# Altium schematic sheet Buck_circuit.SchDoc
size A4; SheetNumber: 2; SheetTotal: 2
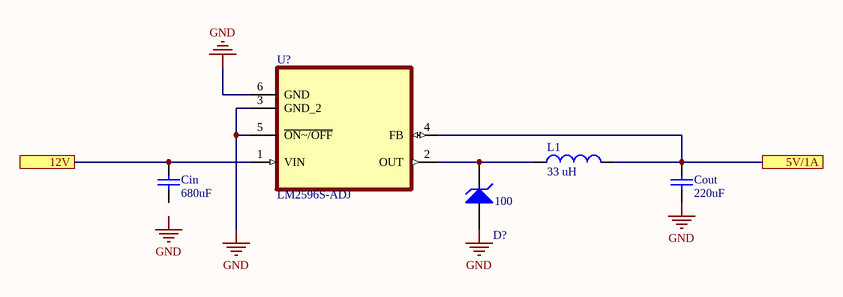
[diagram p0: Buck_circuit.SchDoc]

## Parts
Cin  value 680uF  (hidden comment: Capacitor)
Cout  value 220uF  (hidden comment: Capacitor)
D?  BV: 100  (hidden comment: Zener Diode)
L1  value 33 uH  (hidden comment: Inductor)
U?  LM2596S-ADJ  [TO170P1435X465-6N]

## Ports
5V/1A, 12V

## Nets
GND: Cout.1 D?.1(A) U?.3(GND_2) U?.5(~{ON~/OFF}) U?.6(GND)
5V/1A: Cout.2 L1.2 U?.4(FB) ; port 5V/1A
12V: Cin.2 U?.1(VIN) ; port 12V
NetD?_2: D?.2(K) L1.1 U?.2(OUT)

Not connected (* = marked no-connect by the designer): Cin 1

## Notes on the sheet
- Labels drawn without touching a wire or pin: GND

## Library data of the parts
Cin Cout = Capacitor: SimulationGenericComponent: True
D? = Zener Diode: AF: 1; BV_MAX: 1e99; CJO: 0; EG: 1.11; FC: 0.5; IBV: 0.001; IS: 1e-14; MJSW: 0.33; NTUN: 30; TNOM: 27; XTI: 3; SimulationGenericComponent: True; CJP: 0; CTA: 0; CTP: 0; FCS: 0.5; FV_MAX: 1e99; IKF: 0; IKR: 0; ISR: 1e-14; JSW: 0; JTUN: 0; JTUNSW: 0; KEG: 1; KF: 0; LEVEL: 1; N: 1; NBV: 1; NR: 1; NS: 1; PHP: 1; RS: 0; TCV: 0; TLEV: 0; TLEVC: 0; TM1: 0; TM2: 0; TPB: 0; TPHP: 0; TRS: 0; TRS2: 0; TT: 0; TTT1: 0; TTT2: 0; VJ: 1; XTITUN: 3
L1 = Inductor: SimulationGenericComponent: True
U? = LM2596S-ADJ: Buck Switching Regulator IC Positive Adjustable 1.2V 1 Output 3A TO-263-6, DÂ²Pak (5 Leads + Tab), TO-263BA; MF: UMW; SnapEDA_Link: https://www.snapeda.com/parts/LM2596S-ADJ/Umwelt+Sensor+Teknik/view-part/?ref=snap; Package: None; Value: *; MP: LM2596S-ADJ; Check_prices: https://www.snapeda.com/parts/LM2596S-ADJ/Umwelt+Sensor+Teknik/view-part/?ref=eda